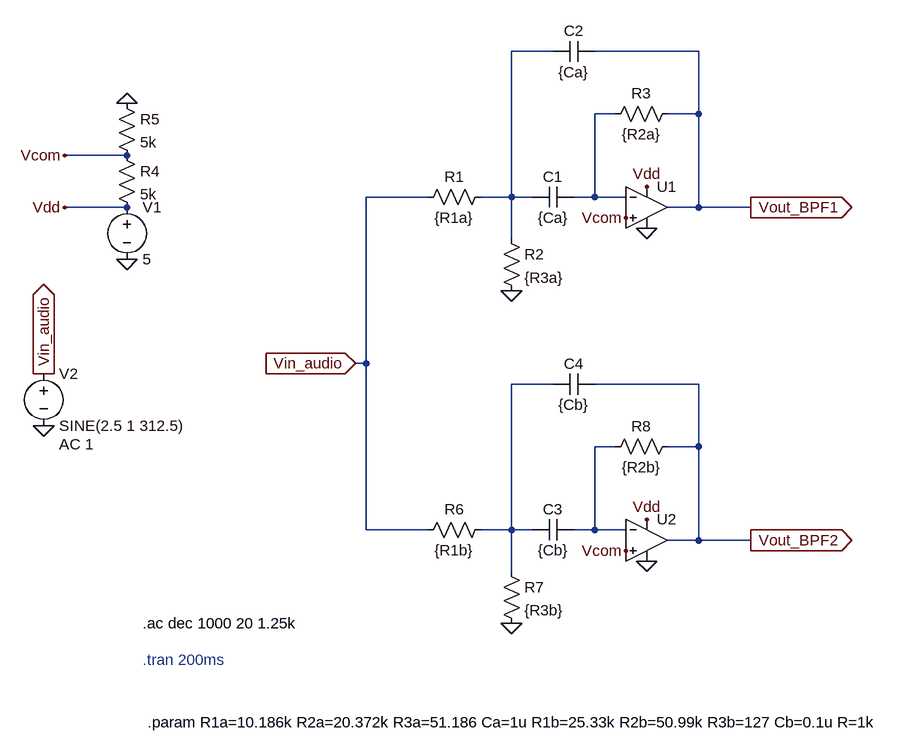
[diagram p0: schematic Exp4.asc]
Exp4.asc, the LTspice schematic file:
Version 4
SHEET 1 1220 888
WIRE 256 -160 192 -160
WIRE 480 -160 320 -160
WIRE 352 -64 320 -64
WIRE 480 -64 480 -160
WIRE 480 -64 432 -64
WIRE -400 0 -496 0
WIRE 64 64 -32 64
WIRE 192 64 192 -160
WIRE 192 64 144 64
WIRE 224 64 192 64
WIRE 320 64 320 -64
WIRE 320 64 288 64
WIRE 368 64 320 64
WIRE -400 80 -496 80
WIRE 480 80 480 -64
WIRE 480 80 432 80
WIRE 560 80 480 80
WIRE 192 128 192 64
WIRE -32 320 -32 64
WIRE -32 320 -48 320
WIRE 256 352 192 352
WIRE 480 352 320 352
WIRE 352 448 320 448
WIRE 480 448 480 352
WIRE 480 448 432 448
WIRE -32 576 -32 320
WIRE 64 576 -32 576
WIRE 192 576 192 352
WIRE 192 576 144 576
WIRE 224 576 192 576
WIRE 320 576 320 448
WIRE 320 576 288 576
WIRE 368 576 320 576
WIRE 480 592 480 448
WIRE 480 592 432 592
WIRE 560 592 480 592
WIRE 192 640 192 576
FLAG 400 112 0
FLAG 192 208 0
FLAG -400 160 0
FLAG -400 -80 0
FLAG 400 624 0
FLAG 192 720 0
FLAG 560 80 Vout_BPF1
IOPIN 560 80 Out
FLAG 560 592 Vout_BPF2
IOPIN 560 592 Out
FLAG -48 320 Vin_audio
IOPIN -48 320 In
FLAG -496 0 Vcom
FLAG 368 96 Vcom
FLAG 368 608 Vcom
FLAG -496 80 Vdd
FLAG 400 560 Vdd
FLAG 400 48 Vdd
FLAG -528 416 0
FLAG -528 336 Vin_audio
IOPIN -528 336 Out
SYMBOL res 160 48 R90
WINDOW 0 0 56 VBottom 2
WINDOW 3 32 56 VTop 2
SYMATTR InstName R1
SYMATTR Value {R1a}
SYMBOL res 176 112 R0
SYMATTR InstName R2
SYMATTR Value {R3a}
SYMBOL cap 224 48 M90
WINDOW 0 0 32 VBottom 2
WINDOW 3 32 32 VTop 2
SYMATTR InstName C1
SYMATTR Value {Ca}
SYMBOL cap 256 -176 M90
WINDOW 0 0 32 VBottom 2
WINDOW 3 32 32 VTop 2
SYMATTR InstName C2
SYMATTR Value {Ca}
SYMBOL res 448 -80 R90
WINDOW 0 0 56 VBottom 2
WINDOW 3 32 56 VTop 2
SYMATTR InstName R3
SYMATTR Value {R2a}
SYMBOL UniversalOpAmp2 400 80 R0
SYMATTR InstName U1
SYMBOL voltage -400 64 R0
WINDOW 123 0 0 Left 0
WINDOW 39 0 0 Left 0
SYMATTR InstName V1
SYMATTR Value 5
SYMBOL res -416 -16 R0
SYMATTR InstName R4
SYMATTR Value 5k
SYMBOL res -416 -96 R0
SYMATTR InstName R5
SYMATTR Value 5k
SYMBOL res 160 560 R90
WINDOW 0 0 56 VBottom 2
WINDOW 3 32 56 VTop 2
SYMATTR InstName R6
SYMATTR Value {R1b}
SYMBOL res 176 624 R0
SYMATTR InstName R7
SYMATTR Value {R3b}
SYMBOL cap 224 560 M90
WINDOW 0 0 32 VBottom 2
WINDOW 3 32 32 VTop 2
SYMATTR InstName C3
SYMATTR Value {Cb}
SYMBOL cap 256 336 M90
WINDOW 0 0 32 VBottom 2
WINDOW 3 32 32 VTop 2
SYMATTR InstName C4
SYMATTR Value {Cb}
SYMBOL res 448 432 R90
WINDOW 0 0 56 VBottom 2
WINDOW 3 32 56 VTop 2
SYMATTR InstName R8
SYMATTR Value {R2b}
SYMBOL UniversalOpAmp2 400 592 R0
SYMATTR InstName U2
SYMBOL voltage -528 320 R0
WINDOW 123 24 124 Left 2
WINDOW 39 0 0 Left 0
SYMATTR Value2 AC 1
SYMATTR InstName V2
SYMATTR Value SINE(2.5 1 312.5)
TEXT -376 720 Left 2 !.ac dec 1000 20 1.25k
TEXT -376 776 Left 2 ;.tran 200ms
TEXT -368 872 Left 2 !.param R1a=10.186k R2a=20.372k R3a=51.186 Ca=1u R1b=25.33k R2b=50.99k R3b=127 Cb=0.1u R=1k

The netlist it stands for:
* Exp4.asc
R1 N001 Vin_audio {R1a}
R2 N001 0 {R3a}
C1 N001 N002 {Ca}
C2 N001 Vout_BPF1 {Ca}
R3 Vout_BPF1 N002 {R2a}
XU1 Vcom N002 Vdd 0 Vout_BPF1 level2 Avol=1Meg GBW=10Meg Slew=10Meg Ilimit=25m Rail=0 Vos=0 En=0 Enk=0 In=0 Ink=0 Rin=500Meg  ; pins In+ In- V+ V- OUT
V1 Vdd 0 5
R4 Vcom Vdd 5k
R5 0 Vcom 5k
R6 N003 Vin_audio {R1b}
R7 N003 0 {R3b}
C3 N003 N004 {Cb}
C4 N003 Vout_BPF2 {Cb}
R8 Vout_BPF2 N004 {R2b}
XU2 Vcom N004 Vdd 0 Vout_BPF2 level2 Avol=1Meg GBW=10Meg Slew=10Meg Ilimit=25m Rail=0 Vos=0 En=0 Enk=0 In=0 Ink=0 Rin=500Meg  ; pins In+ In- V+ V- OUT
V2 Vin_audio 0 SINE(2.5 1 312.5) AC 1
.ac dec 1000 20 1.25k
* .tran 200ms
.param R1a=10.186k R2a=20.372k R3a=51.186 Ca=1u R1b=25.33k R2b=50.99k R3b=127 Cb=0.1u R=1k
.lib UniversalOpAmp2.lib
.backanno
.end